# Altium project PCB_Project_NIIAS.PrjPcb
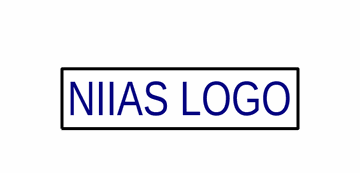
[diagram p0: Sheet1.SchDoc]
Date_Approved: DD/MM/YYYY; Date_Checked: DD/MM/YYYY; Date_Drawn: DD/MM/YYYY; File_Title: Короткое название для файлов выходной документации; NIIAS_Approver: Approver's name; NIIAS_Author: Author's name; NIIAS_Checker: Checker's name; NIIAS_Name: Наименование сборки печатной платы; PCB_Number: Децимальный номер печатного основания; PCBA_Date: DD/MM/YYYY; PCBA_Description: Краткое описание сборки; PCBA_Number: Децимальный номер сборки ПП; Revision: A
1 sheet, 1 parts. Net scope: global (net labels, ports and power ports of the same name join across sheets).
Board file: PCB_NIIAS.PcbDoc

## Sheet Sheet1.SchDoc
size 420 x 297 mm; Author: ALTIUM GOSTBOM2.0 KEV; Перв.Примен.: Перв.Примен.; Проект: Проект; Наименование_организации: Наименование_организации; п_Разраб_Р: п_Разраб_Р; п_Пров_Р: п_Пров_Р; п_Утв_Р: п_Утв_Р

### Parts
?  LOGO_NIIAS  [LOGO NIIAS]  (value not drawn)  (no BOM)

### Notes on the sheet
- Перв. примен.
- Справ. №
- Подп. дата
- Инв. № дубл.
- Взам. инв. №
- Подп. и дата
- Изм.
- Разраб.
- Лист
- № докум.
- Подп.
- Дата
- Лит.
- Масса
- Масштаб
- Пров.
- Т.контр.
- Листов
- Инв. № подл.
- Н.контр.
- Утв.
- НИИАС
- ALTIUM GOSTBOM2.0 KEV
- Файл:
- Копировал
- Формат А3
- (in symbol LOGO_NIIAS-1) NIIAS LOGO

### Library data of the parts
? = LOGO_NIIAS-1